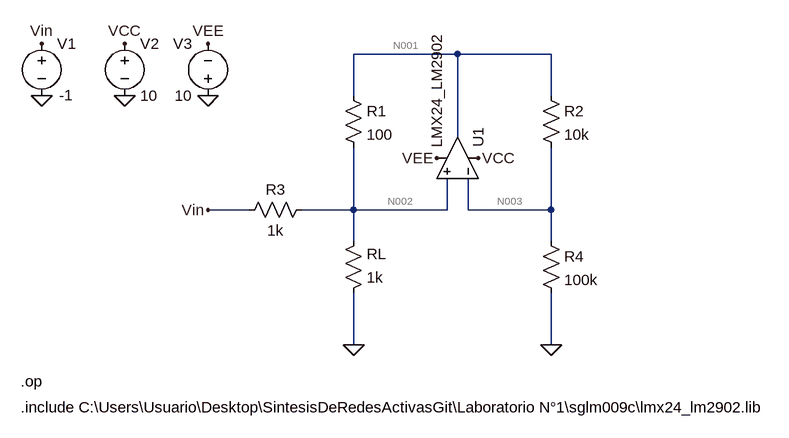
[diagram p0: schematic Laboratorio1-CircuitoII.asc]
Laboratorio1-CircuitoII.asc, the LTspice schematic file:
Version 4
SHEET 1 964 680
WIRE 352 -16 192 -16
WIRE 496 -16 352 -16
WIRE 192 48 192 -16
WIRE 496 48 496 -16
WIRE 352 112 352 -16
WIRE 32 224 -32 224
WIRE 192 224 192 128
WIRE 192 224 112 224
WIRE 336 224 336 176
WIRE 336 224 192 224
WIRE 368 224 368 176
WIRE 496 224 496 128
WIRE 496 224 368 224
WIRE 192 272 192 224
WIRE 496 272 496 224
WIRE 192 432 192 352
WIRE 496 432 496 352
FLAG -32 224 Vin
FLAG -288 -32 Vin
FLAG -288 48 0
FLAG 496 432 0
FLAG -160 -32 VCC
FLAG -160 48 0
FLAG -32 -32 VEE
FLAG -32 48 0
FLAG 320 144 VEE
FLAG 384 144 VCC
FLAG 192 432 0
DATAFLAG 496 224 ""
DATAFLAG 192 224 ""
DATAFLAG 352 -16 ""
SYMBOL res 176 32 R0
SYMATTR InstName R1
SYMATTR Value 100
SYMBOL res 480 32 R0
SYMATTR InstName R2
SYMATTR Value 10k
SYMBOL res 480 256 R0
SYMATTR InstName R4
SYMATTR Value 100k
SYMBOL res 128 208 R90
WINDOW 0 0 56 VBottom 2
WINDOW 3 32 56 VTop 2
SYMATTR InstName R3
SYMATTR Value 1k
SYMBOL res 176 368 M180
WINDOW 0 36 76 Left 2
WINDOW 3 36 40 Left 2
SYMATTR InstName RL
SYMATTR Value 1k
SYMBOL voltage -288 -48 R0
WINDOW 3 27 95 Left 2
WINDOW 123 0 0 Left 0
WINDOW 39 0 0 Left 0
SYMATTR Value -1
SYMATTR InstName V1
SYMBOL voltage -160 -48 R0
WINDOW 123 0 0 Left 0
WINDOW 39 0 0 Left 0
SYMATTR InstName V2
SYMATTR Value 10
SYMBOL voltage -32 64 R180
WINDOW 0 24 96 Left 2
WINDOW 3 24 16 Left 2
WINDOW 123 0 0 Left 0
WINDOW 39 0 0 Left 0
SYMATTR InstName V3
SYMATTR Value 10
SYMBOL OpAmps\\opamp2 416 144 M270
SYMATTR InstName U1
SYMATTR Value LMX24_LM2902
TEXT -320 488 Left 2 !.op
TEXT -320 528 Left 2 !.include C:\\Users\\Usuario\\Desktop\\SintesisDeRedesActivasGit\\Laboratorio N°1\\sglm009c\\lmx24_lm2902.lib

The netlist it stands for:
* Laboratorio1-CircuitoII.asc
R1 N001 N002 100
R2 N001 N003 10k
R4 N003 0 100k
R3 N002 Vin 1k
RL 0 N002 1k
V1 Vin 0 -1
V2 VCC 0 10
V3 0 VEE 10
XU1 N002 N003 VCC VEE N001 LMX24_LM2902  ; pins In+ In- V+ V- OUT
.op
.include C:\Users\Usuario\Desktop\SintesisDeRedesActivasGit\Laboratorio N°1\sglm009c\lmx24_lm2902.lib
.backanno
.end

* Results of the author's LTspice run, read from the files saved beside the schematic
* Operating Point:
*   V(n001) = -1.068 V
*   V(n002) = -973 mV
*   V(n003) = -970.3 mV
*   V(vin) = -1 V
*   V(vcc) = 10 V
*   V(vee) = -10 V
*   I(Rl) = 973 µA
*   I(R3) = 27.03 µA
*   I(R4) = -9.703 µA
*   I(R2) = -9.721 µA
*   I(R1) = -946 µA
*   I(V3) = -1.131 mA
*   I(V2) = -175 µA
*   I(V1) = 27.03 µA
*   Ix(u1:IN+) = -20 nA
*   Ix(u1:IN-) = -18 nA
*   Ix(u1:VCC) = 175 µA
*   Ix(u1:VEE) = -1.131 mA
*   Ix(u1:OUT) = 955.7 µA
* From the log:
*   Semiconductor Device Operating Points:
*                           --- Diodes ---
*   Name:  d:u1:e_n:2  d:u1:e_n:1  d:u1:i_np:2  d:u1:i_np:1  d:u1:i_nn:2
*   Model: u1:e_n:dvn  u1:e_n:dvn  u1:i_np:dvnf u1:i_np:dvnf u1:i_nn:dvnf
*   Id:      1.00e-02    1.00e-02    1.00e-02     1.00e-02     1.00e-02
*   Vd:      8.34e-01    8.34e-01    8.34e-01     8.34e-01     8.34e-01
*   Req:     2.59e+00    2.59e+00    2.59e+00     2.59e+00     2.59e+00
*   CAP:     0.00e+00    0.00e+00    0.00e+00     0.00e+00     0.00e+00
*   Name:  d:u1:i_nn:1
*   Model: u1:i_nn:dvnf
*   Id:      1.00e-02
*   Vd:      8.34e-01
*   Req:     2.59e+00
*   CAP:     0.00e+00